# EAGLE design 2rfm69 (EAGLE 6.5.0)
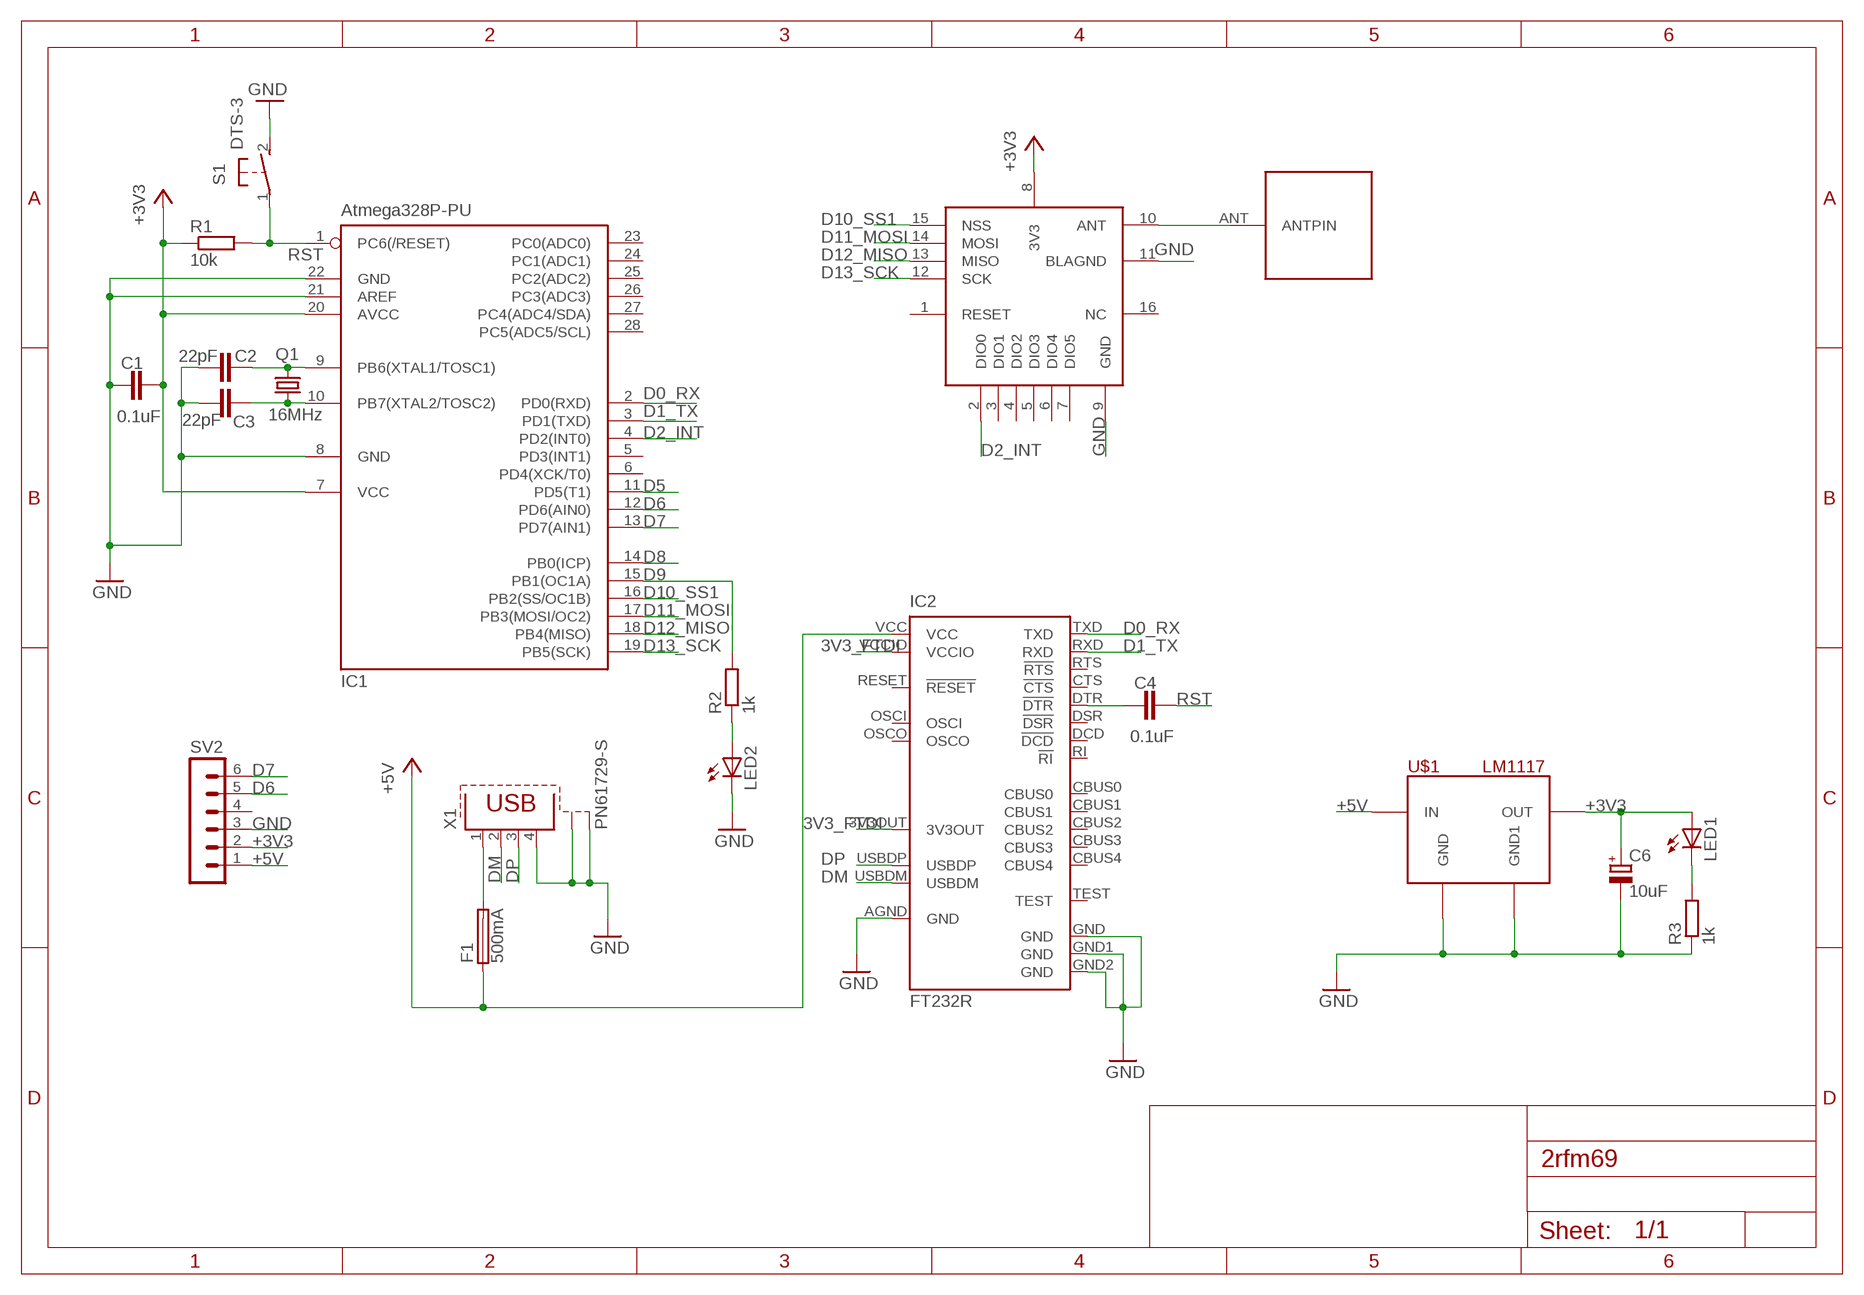
[diagram p0: schematic, sheet 1]

## Parts
C1  0.1uF  C-EU050-025X075  [C050-025X075]
C2  22pF  C-EU050-025X075  [C050-025X075]
C3  22pF  C-EU050-025X075  [C050-025X075]
C4  0.1uF  C-EU050-025X075  [C050-025X075]
C6  10uF  CPOL-EUE2,5-6E  [E2,5-6E]
F1  500mA  TE5  [TE5]
IC1  Atmega328P-PU  MEGA8-P  [DIL28-3]
IC2  FT232R  [DIL28-6]
LED1  LED3MM  [LED3MM]
LED2  LED3MM  [LED3MM]
Q1  16MHz  CRYSTALHC49S  [HC49/S]
R1  10k  R-EU_0204/7  [0204/7]
R2  1k  R-EU_0204/7  [0204/7]
R3  1k  R-EU_0204/7  [0204/7]
S1  DTS-3  [DTS-3]
SV2  MA06-1  [MA06-1]
U1  RFM69  RFM692  [RFM69]
U$1  LM1117  [SOT223]
U$2  ANT  [ANT]
X1  PN61729-S  [PN61729-S]

## Nets
3V3_FTDI: IC2.3V3OUT IC2.VCCIO
+3V3: C1.2 C6.+ IC1.7(VCC) IC1.20(AVCC) LED1.A R1.1 SV2.2 U1.8(3V3) U$1.VOUT(OUT)
+5V: F1.1 IC2.VCC SV2.1 U$1.VIN(IN)
D0_RX: IC1.2(PD0(RXD)) IC2.TXD
D1_TX: IC1.3(PD1(TXD)) IC2.RXD
D2_INT: IC1.4(PD2(INT0)) U1.2(DIO0)
D5: IC1.11(PD5(T1))
D6: IC1.12(PD6(AIN0)) SV2.5
D7: IC1.13(PD7(AIN1)) SV2.6
D8: IC1.14(PB0(ICP))
D9: IC1.15(PB1(OC1A)) R2.2
D10_SS1: IC1.16(PB2(SS/OC1B)) U1.15(NSS)
D11_MOSI: IC1.17(PB3(MOSI/OC2)) U1.14(MOSI)
D12_MISO: IC1.18(PB4(MISO)) U1.13(MISO)
D13_SCK: IC1.19(PB5(SCK)) U1.12(SCK)
DM: IC2.USBDM X1.2
DP: IC2.USBDP X1.3
GND: C1.1 C2.1 C3.1 C6.- IC1.8(GND) IC1.21(AREF) IC1.22(GND) IC2.AGND(GND) IC2.GND IC2.GND1(GND) IC2.GND2(GND) LED2.K(C) R3.1 S1.2 SV2.3 U1.9(GND) U1.11(BLAGND) U$1.GND U$1.GND1 X1.4 X1.S1 X1.S2
N$1: C2.2 IC1.9(PB6(XTAL1/TOSC1)) Q1.1
N$2: C3.2 IC1.10(PB7(XTAL2/TOSC2)) Q1.2
N$3: C4.1 IC2.DTR(!DTR)
N$4: U1.10(ANT) U$2.ANT(ANTPIN)
N$5: LED1.K(C) R3.2
N$6: LED2.A R2.1
N$8: F1.2 X1.1
RST: C4.2 IC1.1(PC6(/RESET)) R1.2 S1.1
Unconnected: IC1.5(PD3(INT1)) IC1.6(PD4(XCK/T0)) IC1.23(PC0(ADC0)) IC1.24(PC1(ADC1)) IC1.25(PC2(ADC2)) IC1.26(PC3(ADC3)) IC1.27(PC4(ADC4/SDA)) IC1.28(PC5(ADC5/SCL)) IC2.CBUS0 IC2.CBUS1 IC2.CBUS2 IC2.CBUS3 IC2.CBUS4 IC2.CTS(!CTS) IC2.DCD(!DCD) IC2.DSR(!DSR) IC2.OSCI IC2.OSCO IC2.RESET(!RESET) IC2.RI(!RI) IC2.RTS(!RTS) IC2.TEST SV2.4 U1.1(RESET) U1.3(DIO1) U1.4(DIO2) U1.5(DIO3) U1.6(DIO4) U1.7(DIO5) U1.16(NC)

## Library data of the parts
C1-C4 = rcl:C-EU: CAPACITOR, European symbol
C6 = rcl:CPOL-EU: POLARIZED CAPACITOR, European symbol
F1 = fuse:TE5: FUSE Wickmann; OC_FARNELL: unknown; OC_NEWARK: unknown
IC1 = atmel:MEGA8-P: MICROCONTROLLER 8 Kbytes FLASH, 1 kbytes SRAM, 512 bytes EEPROM, USART, 4-channel 10 bit ADC, 2-channel 8 bit ADC Pin compatible with Atmega48, ATMega88, ATMega168 Source: avr.lbr; OC_FARNELL: unknown; OC_NEWARK: unknown
IC2 = ftdichip:FT232R: Source: http://www.ftdichip.com/Documents/DataSheets/DS_FT232R_v104.pdf
LED1 LED2 = led:LED: LED OSRAM: - CHIPLED LG R971, LG N971, LY N971, LG Q971, LY Q971, LO R971, LY R971 LH N974, LH R974 LS Q976, LO Q976, LY Q976 LO Q996 - Hyper CHIPLED LW Q18S LB Q993, LB Q99A, LB R99A - SideLED LS A670, LO A670, LY A670, LG A670, LP A670 LB A673, LV A673, LT A673, LW A673 LH A674 LY A675 LS A676, LA A676, LO A676, LY A676, LW A676 LS A679, LY A679, LG A679 - Hyper Micro SIDELED® LS Y876, LA Y876, LO Y876, LY Y876 LT Y87S - SmartLED LW L88C, LW L88S LB L89C, LB L89S, LG L890 LS L89K, LO L89K, LY L89K LS L896, LA L896, LO L896, LY L896 - TOPLED LS T670, LO T670, LY T670, LG T670, LP T670 LSG T670, LSP T670, LSY T670, LOP T670, LYG T670 LG T671, LOG T671, LSG T671 LB T673, LV T673, LT T673, LW T673 LH T674 LS T676, LA T676, LO T676, LY T676, LB T676, LH T676, LSB T676, LW T676 LB T67C, LV T67C, LT T67C, LS T67K, LO T67K, LY T67K, LW E67C LS E67B, LA E67B, LO E67B, LY E67B, LB E67C, LV E67C, LT E67C LW T67C LS T679, LY T679, LG T679 LS T770, LO T770, LY T770, LG T770, LP T770 LB T773, LV T773, LT T773, LW T773 LH T774 LS E675, LA E675, LY E675, LS T675 LS T776, LA T776, LO T776, LY T776, LB T776 LHGB T686 LT T68C, LB T68C - Hyper Mini TOPLED® LB M676 - Mini TOPLED Santana® LG M470 LS M47K, LO M47K, LY M47K Source: http://www.osram.convergy.de LUXEON: - LUMILED® LXK2-PW12-R00, LXK2-PW12-S00, LXK2-PW14-U00, LXK2-PW14-V00 LXK2-PM12-R00, LXK2-PM12-S00, LXK2-PM14-U00 LXK2-PE12-Q00, LXK2-PE12-R00, LXK2-PE12-S00, LXK2-PE14-T00, LXK2-PE14-U00 LXK2-PB12-K00, LXK2-PB12-L00, LXK2-PB12-M00, LXK2-PB14-N00, LXK2-PB14-P00, LXK2-PB14-Q00 LXK2-PR12-L00, LXK2-PR12-M00, LXK2-PR14-Q00, LXK2-PR14-R00 LXK2-PD12-Q00, LXK2-PD12-R00, LXK2-PD12-S00 LXK2-PH12-R00, LXK2-PH12-S00 LXK2-PL12-P00, LXK2-PL12-Q00, LXK2-PL12-R00 Source: www.luxeon.com KINGBRIGHT: KA-3528ASYC Source: www.kingbright.com
Q1 = crystal:CRYSTAL: CRYSTAL; OC_FARNELL: 1667008; OC_NEWARK: unknown
R1-R3 = rcl:R-EU_: RESISTOR, European symbol
S1 = switch-tact:DTS-3
SV2 = con-lstb:MA06-1: PIN HEADER; OC_FARNELL: unknown; OC_NEWARK: unknown
U1 = rfm69:RFM692
U$1 = 1117:LM1117
U$2 = rfm69:ANT
X1 = con-berg:PN61729-S: BERG USB connector; OC_FARNELL: unknown; OC_NEWARK: unknown

## Board
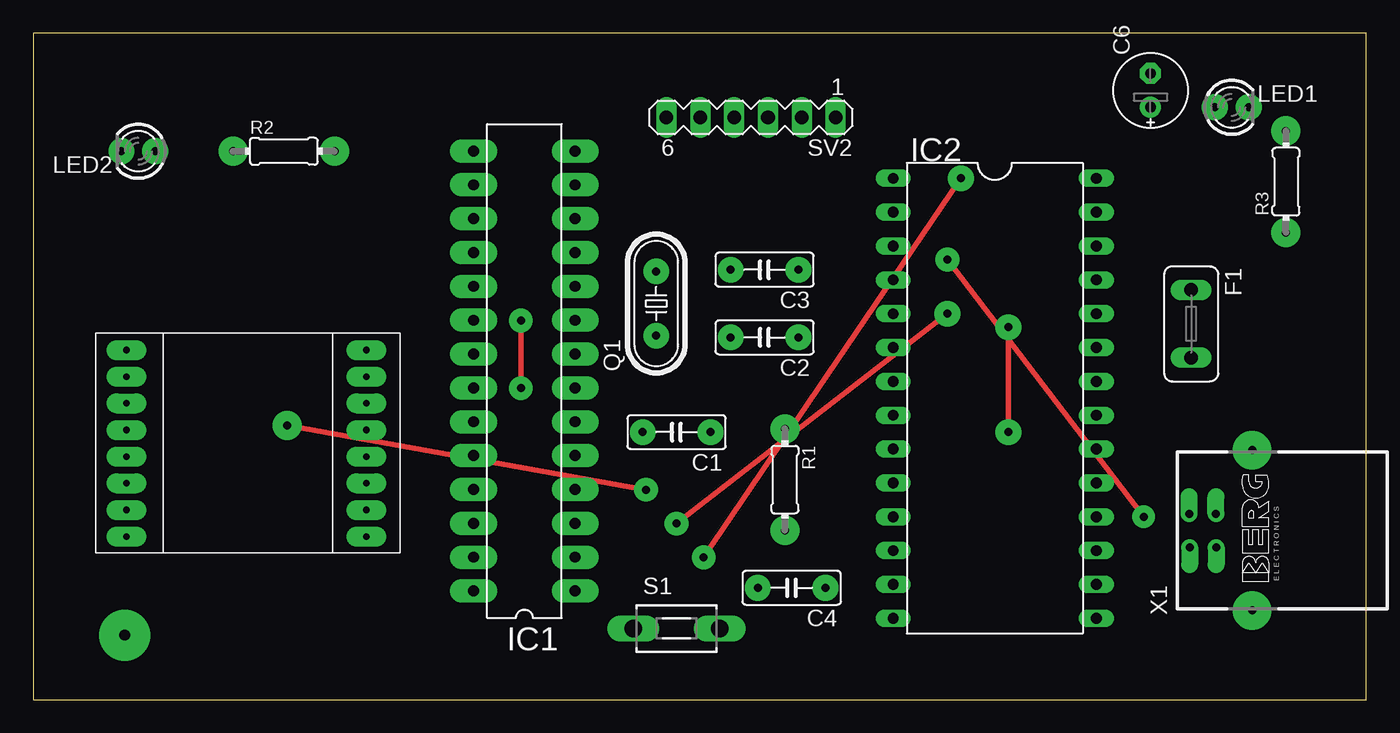
[diagram p1: board, top side]
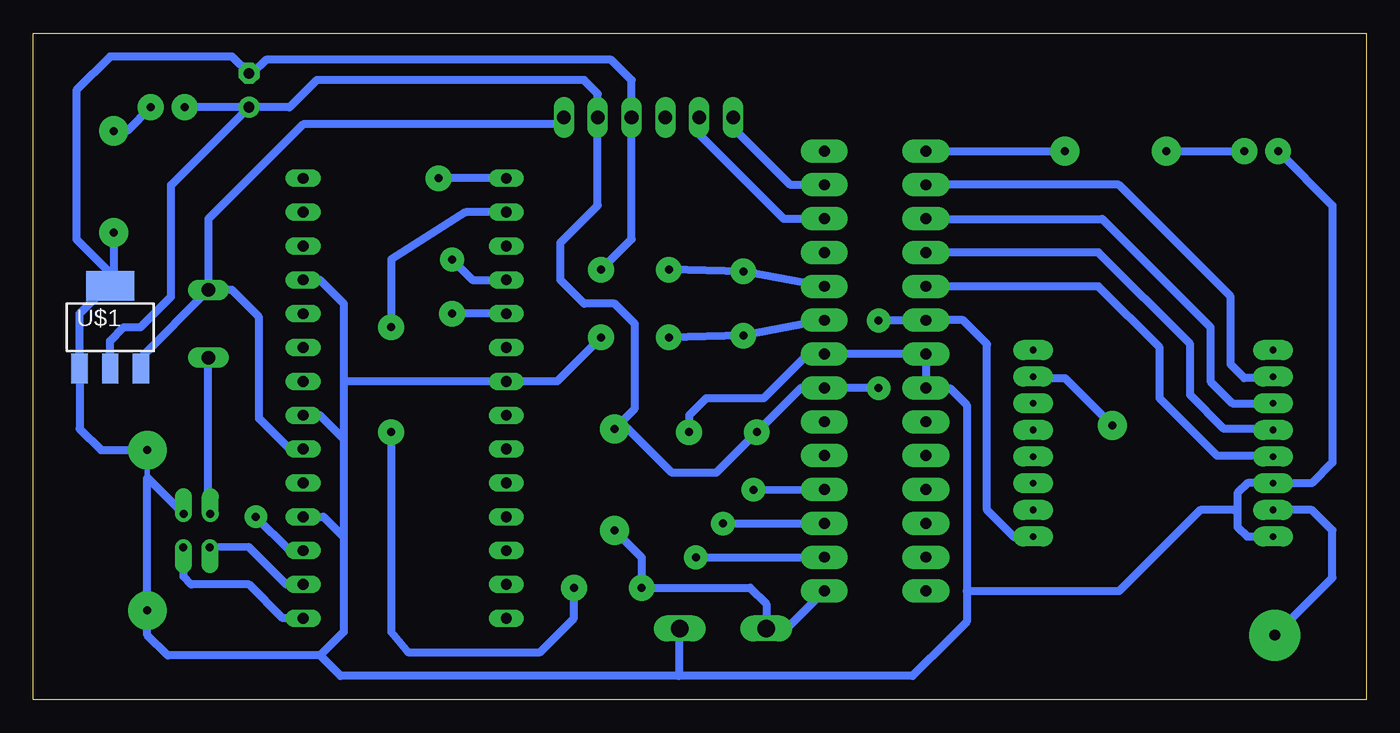
[diagram p2: board, bottom side, seen from below]

Size 100 x 50 mm. Coordinates in mm from the lower left corner, seen from the top.
Outline: 0,0 100,0 100,50 0,50 0,0
Copper layers (1*16): Top 0.035mm / dielectric 1.5mm / Bottom 0.035mm
Design rules "default": minimum track width 10mil, minimum drill 24mil, track to track 8mil, track to pad 8mil, pad to pad 8mil, via to via 8mil, smd to smd 8mil, copper to edge 40mil, drill to drill 8mil, minimum pad ring 10mil, minimum via ring 8mil, stop-mask expansion 4mil, vias tented up to drill 0mil, thermal gap 10mil

### Footprints (pad centres in the part's own frame; a part is rotated, then mirrored left to right if it is on the bottom)
C050-025X075 = drill 0.6 pad 1.93: 1 -2.54,0; 2 2.54,0
E2,5-6E = drill 0.813 pad 1.575: + -1.27,0 | drill 0.813 pad 1.575 octagon: - 1.27,0
TE5 = drill 1.016 long: 1 -2.54,0; 2 2.54,0
DIL28-3 = drill 0.813 pad 1.778 long: 1 -16.51,-3.81; 2 -13.97,-3.81; 3 -11.43,-3.81; 4 -8.89,-3.81; 5 -6.35,-3.81; 6 -3.81,-3.81; 7 -1.27,-3.81; 8 1.27,-3.81; 9 3.81,-3.81; 10 6.35,-3.81; 11 8.89,-3.81; 12 11.43,-3.81; 13 13.97,-3.81; 14 16.51,-3.81; 15 16.51,3.81; 16 13.97,3.81; 17 11.43,3.81; 18 8.89,3.81; 19 6.35,3.81; 20 3.81,3.81; 21 1.27,3.81; 22 -1.27,3.81; 23 -3.81,3.81; 24 -6.35,3.81; 25 -8.89,3.81; 26 -11.43,3.81; 27 -13.97,3.81; 28 -16.51,3.81
DIL28-6 = drill 0.813 long: 3V3OUT 11.43,7.62; AGND -8.89,7.62; CBUS0 -3.81,7.62; CBUS1 -1.27,7.62; CBUS2 13.97,-7.62; CBUS3 16.51,-7.62; CBUS4 11.43,-7.62; CTS 8.89,-7.62; DCD 6.35,-7.62; DSR 3.81,-7.62; DTR -13.97,-7.62; GND -1.27,-7.62; GND1 1.27,7.62; GND2 8.89,7.62; NC 1.27,-7.62; NC1 -6.35,7.62; OSCI -13.97,7.62; OSCO -16.51,7.62; RESET 6.35,7.62; RI -3.81,-7.62; RTS -11.43,-7.62; RXD -6.35,-7.62; TEST -11.43,7.62; TXD -16.51,-7.62; USBDM 13.97,7.62; USBDP 16.51,7.62; VCC 3.81,7.62; VCCIO -8.89,-7.62
LED3MM = drill 0.6 pad 1.93: A -1.27,0; K 1.27,0
HC49/S = drill 0.6 pad 1.93: 1 -2.413,0; 2 2.413,0
0204/7 = drill 0.6 pad 2.184: 1 -3.81,0; 2 3.81,0
DTS-3 = drill 1.3 long: 1 -3.25,0; 2 3.25,0
MA06-1 = drill 1.016 long: 1 -6.35,0; 2 -3.81,0; 3 -1.27,0; 4 1.27,0; 5 3.81,0; 6 6.35,0
RFM69 = drill 0.5 pad 1.5 long: 1 -6.35,8.89; 2 -4.35,8.89; 3 -2.35,8.89; 4 -0.35,8.89; 5 1.65,8.89; 6 3.65,8.89; 7 5.65,8.89; 8 7.65,8.89; 9 7.65,-9.11; 10 5.65,-9.11; 11 3.65,-9.11; 12 1.65,-9.11; 13 -0.35,-9.11; 14 -2.35,-9.11; 15 -4.35,-9.11; 16 -6.35,-9.11
SOT223 = smd 1.219 x 2.235: GND -2.311,-3.099; VIN 2.311,-3.099; VOUT 0,-3.099 | smd 3.6 x 2.2: GND1 0,3.099
ANT = drill 0.8 pad 3.81: ANT 0,0
PN61729-S = drill 0.6 pad 1.27 offset: 1 1.25,4.71; 2 -1.29,4.688; 3 -1.29,2.7; 4 1.25,2.71 | drill 0.6 pad 2.9: S1 -6.02,0; S2 6.02,0

### Placement (x,y rotation side)
C1  48.26,20.07 180 top
C2  54.86,27.18 180 top
C3  54.86,32.26 180 top
C4  56.9,8.38 180 top
C6  83.82,45.72 90 top
F1  86.87,28.19 270 top
IC1  36.84,24.66 90 top
IC2  72.14,22.61 270 top
LED1  89.92,44.45 0 top
LED2  7.87,41.15 180 top
Q1  46.74,29.72 90 top
R1  56.39,16.51 270 top
R2  18.8,41.15 0 top
R3  93.98,38.86 90 top
S1  48.26,5.33 0 top
SV2  53.85,43.69 180 top
U1  16.1,19.88 270 top
U$1  94.23,27.94 0 bottom
U$2  6.86,4.83 0 top
X1  91.44,12.7 90 top

### Tracks (layer width: path | path; a pad name or v marks a point on that pad's centre or on a via)
3V3_FTDI  (via drill 0.6 pad 1.68, 0.6 pad 1.78)
  Top 0.406: v83.31,13.72 v68.58,33.02
  Bottom 0.61: IC2.3V3OUT 80.77,11.18 v83.31,13.72 | v68.58,33.02 67.06,31.5 IC2.VCCIO
+3V3  (via drill 0.6 pad 1.78)
  Top 0.406: v36.58,28.45 v36.58,23.37
  Bottom 0.406: IC1.20 33.05,28.45 | v36.58,23.37 36.59,23.39 | U1.8 25.02,12.19 26.42,12.19 | 55.37,20.32 R1.1
  Bottom 0.61: 33.05,28.45 v36.58,28.45 | 36.59,23.39 IC1.7 42.4,23.39 C1.2 48.77,17.02 52.07,17.02 55.37,20.32 | 26.42,12.19 28.45,14.22 28.45,26.67 30.25,28.47 IC1.20 | R1.1 54.86,21.84 54.86,28.19 56.39,29.72 58.67,29.72 60.45,31.5 60.45,34.29 57.66,37.08 SV2.2 57.66,45.47 58.67,46.48 78.74,46.48 80.77,44.45 C6.+ | U$1.VOUT 94.23,26.92 93.22,27.94 91.95,27.94 89.66,30.23 89.66,38.61 C6.+ | C6.+ LED1.A
+5V
  Bottom 0.406: 91.92,25.68 U$1.VIN
  Bottom 0.61: IC2.VCC 80.77,18.8 83.06,21.08 83.06,28.7 85.09,30.73 F1.1 | 91.92,25.68 F1.1 | SV2.1 60.71,43.18 79.76,43.18 86.87,36.07 F1.1
D0_RX  (via drill 0.6 pad 1.78, 0.6 pad 1.93)
  Top 0.406: v69.6,39.12 v50.29,10.67
  Bottom 0.61: IC2.TXD v69.6,39.12 | v50.29,10.67 IC1.2
D1_TX  (via drill 0.6 pad 1.78, 0.6 pad 1.93)
  Top 0.406: v68.58,28.96 v48.26,13.21
  Bottom 0.61: IC2.RXD v68.58,28.96 | v48.26,13.21 IC1.3
D2_INT  (via drill 0.6 pad 1.78, 0.6 pad 2.18)
  Top 0.406: v19.05,20.57 v45.97,15.75
  Bottom 0.406: U1.2 24.89,24.13
  Bottom 0.61: 24.89,24.13 22.61,24.13 v19.05,20.57 | v45.97,15.75 IC1.4
D6
  Bottom 0.406: IC1.12 40.67,36.07
  Bottom 0.61: 40.67,36.07 43.69,36.07 50.04,42.42 SV2.5
D7
  Bottom 0.406: IC1.13 40.67,38.61
  Bottom 0.61: 40.67,38.61 43.18,38.61 47.5,42.93 SV2.6
D9
  Bottom 0.406: IC1.15 33.01,41.15
  Bottom 0.61: 33.01,41.15 R2.2
D10_SS1
  Bottom 0.406: U1.15 7.08,24.13
  Bottom 0.61: 7.08,24.13 9.14,24.13 10.16,25.15 10.16,30.23 18.56,38.63 IC1.16
D11_MOSI
  Bottom 0.406: IC1.17 33.01,36.07
  Bottom 0.61: 33.01,36.07 19.81,36.07 11.68,27.94 11.68,23.88 10.04,22.23 U1.14
D12_MISO
  Bottom 0.406: U1.13 7.08,20.32
  Bottom 0.61: 7.08,20.32 10.67,20.32 13.21,22.86 13.21,26.67 20.09,33.55 IC1.18
D13_SCK
  Bottom 0.406: U1.12 7.05,18.29
  Bottom 0.61: 7.05,18.29 11.18,18.29 15.49,22.61 15.49,26.42 20.09,31.01 IC1.19
DM
  Bottom 0.61: IC2.USBDM 81.03,8.64 83.84,11.45 X1.2
DP
  Bottom 0.61: IC2.USBDP 81.28,6.1 83.82,8.64 88.14,8.64 88.73,9.23 X1.3
GND
  Bottom 0.406: 91.44,16.66 X1.S2 | U1.11 7.01,16.26 | IC1.8 40.67,25.91 | 40.67,25.91 41.91,25.91 | IC1.22 33.01,23.37 | 96.52,24.82 U$1.GND 96.52,24.87 | 94.44,31.04 U$1.GND1 94.23,30.73 93.98,30.48 93.98,31.75 | 83.57,46.99 C6.- | 40.67,25.91 33.02,25.91 33.02,23.37 31.24,23.37 | 9.65,13.97 9.91,14.22 | S1.2 51.56,5.28
  Bottom 0.61: X1.4 91.44,16.66 X1.S1 91.44,4.83 89.92,3.3 78.49,3.3 | IC1.8 IC1.21 IC1.22 | 7.01,16.26 8.89,16.26 9.65,15.49 9.65,13.97 9.65,12.95 8.93,12.23 U1.9 | LED2.K 2.54,37.08 2.54,17.78 4.09,16.23 U1.11 | 41.91,25.91 45.21,22.61 49.53,22.61 50.8,21.34 C1.1 | 33.01,23.37 31.24,23.37 29.97,22.1 29.97,8.13 | 29.97,8.13 29.97,5.84 31.24,4.57 34.04,1.78 51.56,1.78 | IC2.GND2 78.23,13.72 76.71,12.19 | 76.71,12.19 76.71,5.08 78.49,3.3 | IC2.AGND 78.49,31.5 76.71,29.72 76.71,23.88 | 76.71,23.88 76.71,19.56 | 76.71,19.56 76.71,12.19 | IC2.GND1 78.49,21.34 76.71,19.56 | 76.71,23.88 IC2.GND 60.71,23.88 C2.1 | 96.52,24.82 96.52,20.32 94.92,18.72 X1.S2 | 96.52,24.87 96.52,28.96 94.44,31.04 | R3.1 93.98,31.75 96.77,34.54 96.77,45.72 94.23,48.26 85.09,48.26 C6.- | C3.1 55.12,34.54 SV2.3 55.12,46.48 56.64,48.01 82.55,48.01 83.57,46.99 | 51.56,1.78 76.96,1.78 78.49,3.3 | 9.91,14.22 12.45,14.22 18.54,8.13 29.97,8.13 | 51.56,5.28 51.56,1.78
N$1
  Bottom 0.61: IC1.9 Q1.1 C2.2
N$2
  Bottom 0.61: IC1.10 Q1.2 C3.2
N$3  (via drill 0.6 pad 1.93)
  Top 0.406: v73.15,27.94 v73.15,20.07
  Bottom 0.61: IC2.DTR 67.56,36.58 73.15,33.02 v73.15,27.94 | v73.15,20.07 73.15,5.08 71.88,3.56 61.98,3.56 59.44,6.1 C4.1
N$4
  Bottom 0.61: U$2.ANT 2.54,9.14 2.54,12.7 4.07,14.23 U1.10
N$5
  Bottom 0.406: 92.96,42.67 R3.2
  Bottom 0.61: LED1.K 92.96,42.67
N$6
  Bottom 0.61: R2.1 LED2.A
N$8
  Bottom 0.406: X1.1 86.87,14.09
  Bottom 0.61: 86.87,14.09 F1.2
RST
  Bottom 0.61: IC1.1 43.47,5.33 S1.1 45.01,7.16 46.23,8.38 C4.2 54.36,10.67 R1.2